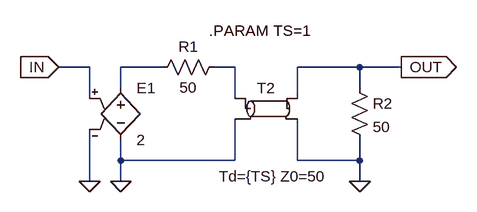
[diagram p0: schematic Z_1_tl.asc]
Z_1_tl.asc, the LTspice schematic file:
Version 4
SHEET 1 880 680
WIRE 192 256 192 224
WIRE 192 224 256 224
WIRE 368 224 368 272
WIRE 192 336 192 368
WIRE 192 368 368 368
WIRE 368 368 368 304
WIRE 144 320 144 400
WIRE 144 272 144 224
WIRE 144 224 96 224
WIRE 560 256 560 224
WIRE 560 224 464 224
WIRE 464 224 464 272
WIRE 464 304 464 368
WIRE 464 368 560 368
WIRE 560 368 560 336
WIRE 560 224 624 224
WIRE 192 368 192 400
WIRE 560 400 560 368
WIRE 336 224 368 224
FLAG 192 400 0
FLAG 144 400 0
FLAG 560 400 0
FLAG 96 224 IN
IOPIN 96 224 In
FLAG 624 224 OUT
IOPIN 624 224 Out
SYMBOL tline 416 288 R0
WINDOW 3 -73 104 Left 0
SYMATTR InstName T2
SYMATTR Value Td={TS} Z0=50
SYMBOL e 192 240 R0
SYMATTR InstName E1
SYMATTR Value 2
SYMBOL res 544 240 R0
SYMATTR InstName R2
SYMATTR Value 50
SYMBOL res 240 240 R270
WINDOW 0 32 56 VTop 0
WINDOW 3 0 56 VBottom 0
SYMATTR InstName R1
SYMATTR Value 50
TEXT 328 168 Left 0 !.PARAM TS=1

The netlist it stands for:
* Z_1_tl.asc
T2 N002 0 OUT 0 Td={TS} Z0=50
E1 N001 0 IN 0 2
R2 OUT 0 50
R1 N001 N002 50
.PARAM TS=1
.backanno
.end